# EAGLE schematic daughter-pots2 (EAGLE 6.6.0)
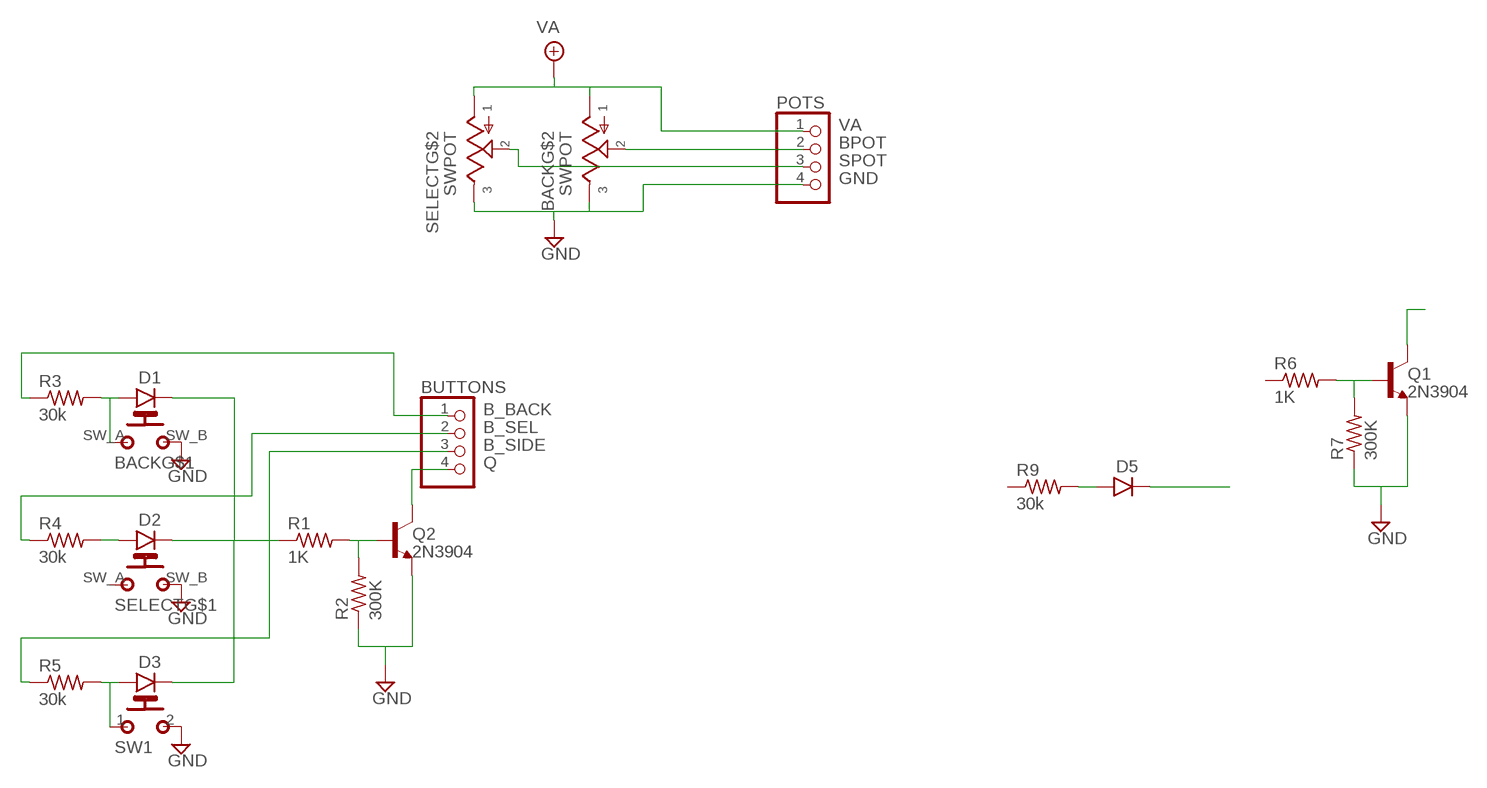
[diagram p0: schematic, sheet 1]

## Parts
BACK  SWPOT  [SWPOT]
BUTTONS  PINHD-1X4  [1X04]
D1  1N4148-3  [DO35-3]
D2  1N4148-3  [DO35-3]
D3  1N4148-3  [DO35-3]
D5  1N4148-3  [DO35-3]
POTS  PINHD-1X4  [1X04]
Q1  2N3904  [TO92-]
Q2  2N3904  [TO92-]
R1  1K  6MM.3  [R0207/3]
R2  300K  6MM.3  [R0207/3]
R3  30k  6MM.3  [R0207/3]
R4  30k  6MM.3  [R0207/3]
R5  30k  6MM.3  [R0207/3]
R6  1K  6MM.3  [R0207/3]
R7  300K  6MM.3  [R0207/3]
R9  30k  6MM.3  [R0207/3]
SELECT  SWPOT  [SWPOT]
SW1  MOMENTARYSPST1  [SPST]

## Nets
B_BACK: BUTTONS.1 R3.1
B_SEL: BUTTONS.2 R4.1
B_SIDE: BUTTONS.3 R5.1
BPOT: BACK.POT_W POTS.2
GND: BACK.POT_A BACK.SW_B(B_B) POTS.4 Q1.3(E) Q2.3(E) R2.1 R7.1 SELECT.POT_A SELECT.SW_B(B_B) SW1.2(S)
N$1: Q2.2(B) R1.2 R2.2
N$2: D1.C D2.C D3.C R1.1
N$3: Q1.2(B) R6.2 R7.2
N$4: D2.A R4.2
N$5: BACK.SW_A(B_A) D1.A R3.2
N$6: Q1.1(C)
N$7: D5.C
N$8: D3.A R5.2 SW1.1(P)
N$9: D5.A R9.2
Q: BUTTONS.4 Q2.1(C)
SPOT: POTS.3 SELECT.POT_W
VA: BACK.POT_B POTS.1 SELECT.POT_B
Unconnected: R6.1 R9.1 SELECT.SW_A(B_A)

## Library data of the parts
BACK SELECT = jaapie:SWPOT
BUTTONS POTS = pinhead:PINHD-1X4: PIN HEADER
D1-D3 D5 = gm-diodes:1N4148: Fast Switching Diode DO-35 glass case a.k.a. 1N914
Q1 Q2 = gm-trans:2N3904: NPN Transistor
R1-R7 R9 = gm-resistors:6MM: 6mm Resistors Leads spaced 1-6 holes apart for 0.1" perfboard. Suitable for 1/4 watt resistors.
SW1 = gm-switches:MOMENTARY